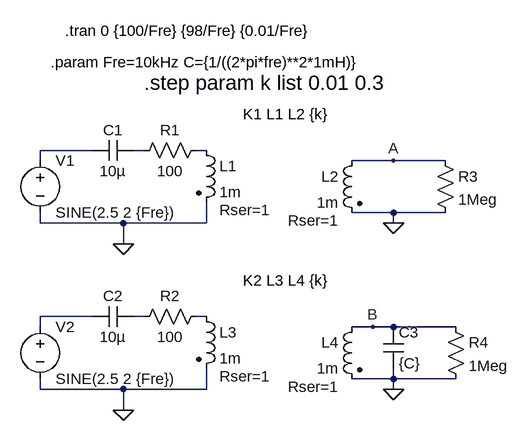
[diagram p0: schematic Draft1.asc]
Draft1.asc, the LTspice schematic file:
Version 4
SHEET 1 880 680
WIRE -80 128 -160 128
WIRE 0 128 -16 128
WIRE 96 128 80 128
WIRE -160 144 -160 128
WIRE 384 144 320 144
WIRE 464 144 384 144
WIRE 384 224 320 224
WIRE 464 224 384 224
WIRE -160 240 -160 224
WIRE -32 240 -160 240
WIRE 96 240 96 208
WIRE 96 240 -32 240
WIRE 384 240 384 224
WIRE -32 272 -32 240
WIRE -80 384 -160 384
WIRE 0 384 -16 384
WIRE 96 384 80 384
WIRE -160 400 -160 384
WIRE 352 400 320 400
WIRE 384 400 352 400
WIRE 480 400 384 400
WIRE 384 480 384 464
WIRE 384 480 320 480
WIRE 480 480 384 480
WIRE -160 496 -160 480
WIRE -32 496 -160 496
WIRE 96 496 96 464
WIRE 96 496 -32 496
WIRE 384 496 384 480
WIRE -32 528 -32 496
FLAG -32 272 0
FLAG -32 528 0
FLAG 384 240 0
FLAG 384 496 0
FLAG 384 144 A
FLAG 352 400 B
SYMBOL ind2 80 112 R0
WINDOW 39 36 108 Left 2
SYMATTR InstName L1
SYMATTR Value 1m
SYMATTR Type ind
SYMATTR SpiceLine Rser=1
SYMBOL res 96 112 R90
WINDOW 0 0 56 VBottom 2
WINDOW 3 32 56 VTop 2
SYMATTR InstName R1
SYMATTR Value 100
SYMBOL voltage -160 128 R0
WINDOW 123 0 0 Left 2
WINDOW 39 0 0 Left 2
SYMATTR InstName V1
SYMATTR Value SINE(2.5 2 {Fre})
SYMBOL cap -16 112 R90
WINDOW 0 0 32 VBottom 2
WINDOW 3 32 32 VTop 2
SYMATTR InstName C1
SYMATTR Value 10µ
SYMBOL ind2 336 128 M0
WINDOW 39 36 108 Left 2
SYMATTR InstName L2
SYMATTR Value 1m
SYMATTR Type ind
SYMATTR SpiceLine Rser=1
SYMBOL ind2 80 368 R0
WINDOW 39 36 108 Left 2
SYMATTR InstName L3
SYMATTR Value 1m
SYMATTR Type ind
SYMATTR SpiceLine Rser=1
SYMBOL res 96 368 R90
WINDOW 0 0 56 VBottom 2
WINDOW 3 32 56 VTop 2
SYMATTR InstName R2
SYMATTR Value 100
SYMBOL voltage -160 384 R0
WINDOW 123 0 0 Left 2
WINDOW 39 0 0 Left 2
SYMATTR InstName V2
SYMATTR Value SINE(2.5 2 {Fre})
SYMBOL cap -16 368 R90
WINDOW 0 0 32 VBottom 2
WINDOW 3 32 32 VTop 2
SYMATTR InstName C2
SYMATTR Value 10µ
SYMBOL ind2 336 384 M0
WINDOW 39 36 108 Left 2
SYMATTR InstName L4
SYMATTR Value 1m
SYMATTR Type ind
SYMATTR SpiceLine Rser=1
SYMBOL res 448 128 R0
SYMATTR InstName R3
SYMATTR Value 1Meg
SYMBOL res 464 384 R0
SYMATTR InstName R4
SYMATTR Value 1Meg
SYMBOL cap 368 400 R0
SYMATTR InstName C3
SYMATTR Value {C}
TEXT 152 72 Left 2 !K1 L1 L2 {k}
TEXT 152 328 Left 2 !K2 L3 L4 {k}
TEXT -144 -8 Left 2 !.param Fre=10kHz C={1/((2*pi*fre)**2*1mН)}
TEXT 0 24 Left 3 !.step param k list 0.01 0.3
TEXT -122 -56 Left 2 !.tran 0 {100/Fre} {98/Fre} {0.01/Fre}

The netlist it stands for:
* Draft1.asc
L1 N003 0 1m Rser=1
R1 N003 N002 100
V1 N001 0 SINE(2.5 2 {Fre})
C1 N002 N001 10µ
L2 A 0 1m Rser=1
L3 N006 0 1m Rser=1
R2 N006 N005 100
V2 N004 0 SINE(2.5 2 {Fre})
C2 N005 N004 10µ
L4 B 0 1m Rser=1
R3 A 0 1Meg
R4 B 0 1Meg
C3 B 0 {C}
K1 L1 L2 {k}
K2 L3 L4 {k}
.param Fre=10kHz C={1/((2*pi*fre)**2*1mН)}
.step param k list 0.01 0.3
.tran 0 {100/Fre} {98/Fre} {0.01/Fre}
.backanno
.end